# EAGLE design source_eagle (EAGLE 9.6.2)
COMPANY: ADAFRUIT INDUSTRIES; DRAWN: KTOWN; REV: A
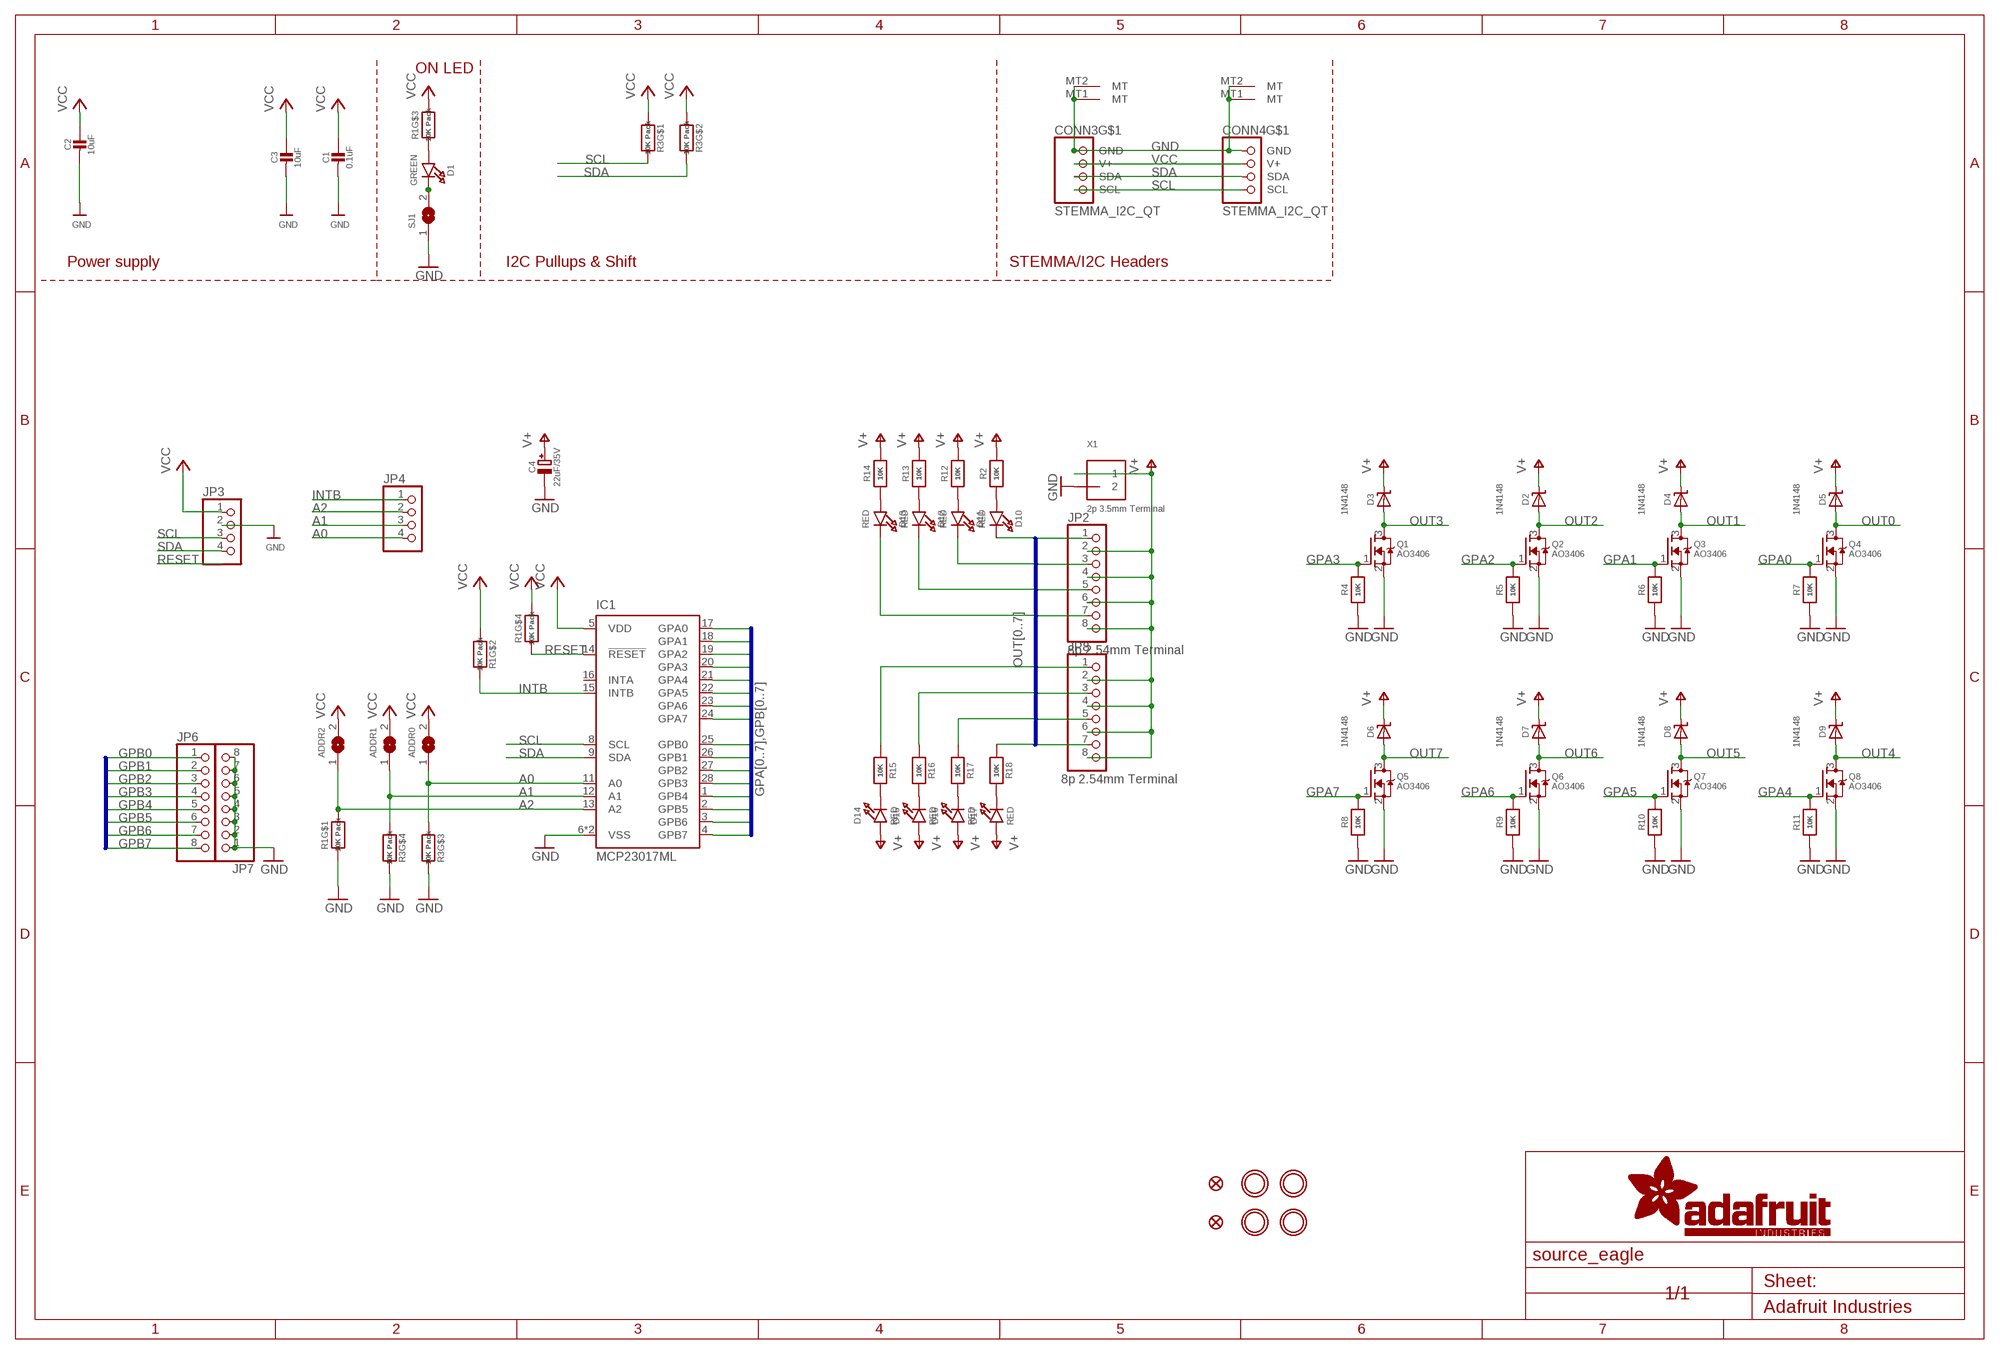
[diagram p0: schematic, sheet 1]

## Parts
ADDR0  SOLDERJUMPER  [SOLDERJUMPER_ARROW_NOPASTE]
ADDR1  SOLDERJUMPER  [SOLDERJUMPER_ARROW_NOPASTE]
ADDR2  SOLDERJUMPER  [SOLDERJUMPER_ARROW_NOPASTE]
C1  0.1uF  CAP_CERAMIC0603_NO  [0603-NO]
C2  10uF  CAP_CERAMIC0805-NOOUTLINE  [0805-NO]
C3  10uF  CAP_CERAMIC0805-NOOUTLINE  [0805-NO]
C4  22uF/35V  CAP_ELECTROLYTICPANASONIC_C  [PANASONIC_C]
CONN3  STEMMA_I2C_QT  [JST_SH4]
CONN4  STEMMA_I2C_QT  [JST_SH4]
D1  GREEN  LED0603_NOOUTLINE  [CHIPLED_0603_NOOUTLINE]
D2  1N4148  DIODE-SCHOTTKYSOD-323  [SOD-323]
D3  1N4148  DIODE-SCHOTTKYSOD-323  [SOD-323]
D4  1N4148  DIODE-SCHOTTKYSOD-323  [SOD-323]
D5  1N4148  DIODE-SCHOTTKYSOD-323  [SOD-323]
D6  1N4148  DIODE-SCHOTTKYSOD-323  [SOD-323]
D7  1N4148  DIODE-SCHOTTKYSOD-323  [SOD-323]
D8  1N4148  DIODE-SCHOTTKYSOD-323  [SOD-323]
D9  1N4148  DIODE-SCHOTTKYSOD-323  [SOD-323]
D10  RED  LED0603_NOOUTLINE  [CHIPLED_0603_NOOUTLINE]
D11  RED  LED0603_NOOUTLINE  [CHIPLED_0603_NOOUTLINE]
D12  RED  LED0603_NOOUTLINE  [CHIPLED_0603_NOOUTLINE]
D13  RED  LED0603_NOOUTLINE  [CHIPLED_0603_NOOUTLINE]
D14  RED  LED0603_NOOUTLINE  [CHIPLED_0603_NOOUTLINE]
D15  RED  LED0603_NOOUTLINE  [CHIPLED_0603_NOOUTLINE]
D16  RED  LED0603_NOOUTLINE  [CHIPLED_0603_NOOUTLINE]
D17  RED  LED0603_NOOUTLINE  [CHIPLED_0603_NOOUTLINE]
FID3  FIDUCIAL_1MM  [FIDUCIAL_1MM]
FID4  FIDUCIAL_1MM  [FIDUCIAL_1MM]
IC1  MCP23017ML  [QFN28-ML_6X6MM]
JP2  8p 2.54mm Terminal  HEADER-1X8_2.54MMTERM  [1X08_2.54MMTERMINAL]
JP3  HEADER-1X4ROUND  [1X04_ROUND]
JP4  HEADER-1X4ROUND  [1X04_ROUND]
JP6  HEADER-1X870MIL  [1X08_ROUND_70]
JP7  HEADER-1X870MIL  [1X08_ROUND_70]
JP8  8p 2.54mm Terminal  HEADER-1X8_2.54MMTERM  [1X08_2.54MMTERMINAL]
Q1  AO3406  MOSFET-NWIDE  [SOT23-WIDE]
Q2  AO3406  MOSFET-NWIDE  [SOT23-WIDE]
Q3  AO3406  MOSFET-NWIDE  [SOT23-WIDE]
Q4  AO3406  MOSFET-NWIDE  [SOT23-WIDE]
Q5  AO3406  MOSFET-NWIDE  [SOT23-WIDE]
Q6  AO3406  MOSFET-NWIDE  [SOT23-WIDE]
Q7  AO3406  MOSFET-NWIDE  [SOT23-WIDE]
Q8  AO3406  MOSFET-NWIDE  [SOT23-WIDE]
R1  10K Pack  RESISTOR_4PACK  [RESPACK_4X0603]
R2  10K  RESISTOR_0603_NOOUT  [0603-NO]
R3  10K Pack  RESISTOR_4PACK  [RESPACK_4X0603]
R4  10K  RESISTOR_0603_NOOUT  [0603-NO]
R5  10K  RESISTOR_0603_NOOUT  [0603-NO]
R6  10K  RESISTOR_0603_NOOUT  [0603-NO]
R7  10K  RESISTOR_0603_NOOUT  [0603-NO]
R8  10K  RESISTOR_0603_NOOUT  [0603-NO]
R9  10K  RESISTOR_0603_NOOUT  [0603-NO]
R10  10K  RESISTOR_0603_NOOUT  [0603-NO]
R11  10K  RESISTOR_0603_NOOUT  [0603-NO]
R12  10K  RESISTOR_0603_NOOUT  [0603-NO]
R13  10K  RESISTOR_0603_NOOUT  [0603-NO]
R14  10K  RESISTOR_0603_NOOUT  [0603-NO]
R15  10K  RESISTOR_0603_NOOUT  [0603-NO]
R16  10K  RESISTOR_0603_NOOUT  [0603-NO]
R17  10K  RESISTOR_0603_NOOUT  [0603-NO]
R18  10K  RESISTOR_0603_NOOUT  [0603-NO]
SJ1  SOLDERJUMPERCLOSED  [SOLDERJUMPER_CLOSEDWIRE]
U$1  MOUNTINGHOLE2.5  [MOUNTINGHOLE_2.5_PLATED]
U$17  MOUNTINGHOLE2.5  [MOUNTINGHOLE_2.5_PLATED]
U$19  MOUNTINGHOLE2.5  [MOUNTINGHOLE_2.5_PLATED]
U$21  MOUNTINGHOLE2.5  [MOUNTINGHOLE_2.5_PLATED]
X1  2p 3.5mm Terminal  TERMBLOCK_1X2_3.5MM  [TERMBLOCK_1X2-3.5MM]

## Nets
A0: ADDR0.1 IC1.11(A0) JP4.4 R3.3
A1: ADDR1.1 IC1.12(A1) JP4.3 R3.4
A2: ADDR2.1 IC1.13(A2) JP4.2 R1.8
GND [highpower]: C1.2 C2.2 C3.2 C4.- CONN3.1(GND) CONN3.MT1(MT) CONN3.MT2(MT) CONN4.1(GND) CONN4.MT1(MT) CONN4.MT2(MT) IC1.6(VSS) IC1.EXP(VSS) JP3.2 JP7.1 JP7.2 JP7.3 JP7.4 JP7.5 JP7.6 JP7.7 JP7.8 Q1.2(S) Q2.2(S) Q3.2(S) Q4.2(S) Q5.2(S) Q6.2(S) Q7.2(S) Q8.2(S) R1.1 R3.5 R3.6 R4.1 R5.1 R6.1 R7.1 R8.1 R9.1 R10.1 R11.1 SJ1.1 X1.2
GPA0: IC1.17(GPA0) Q4.1(G) R7.2
GPA1: IC1.18(GPA1) Q3.1(G) R6.2
GPA2: IC1.19(GPA2) Q2.1(G) R5.2
GPA3: IC1.20(GPA3) Q1.1(G) R4.2
GPA4: IC1.21(GPA4) Q8.1(G) R11.2
GPA5: IC1.22(GPA5) Q7.1(G) R10.2
GPA6: IC1.23(GPA6) Q6.1(G) R9.2
GPA7: IC1.24(GPA7) Q5.1(G) R8.2
GPB0: IC1.25(GPB0) JP6.1
GPB1: IC1.26(GPB1) JP6.2
GPB2: IC1.27(GPB2) JP6.3
GPB3: IC1.28(GPB3) JP6.4
GPB4: IC1.1(GPB4) JP6.5
GPB5: IC1.2(GPB5) JP6.6
GPB6: IC1.3(GPB6) JP6.7
GPB7: IC1.4(GPB7) JP6.8
INTB: IC1.15(INTB) JP4.1 R1.7
N$1: D1.A R1.3
N$2: D1.C SJ1.2
N$3: D10.A R2.1
N$4: D11.A R12.1
N$5: D12.A R13.1
N$6: D13.A R14.1
N$7: D14.C R15.2
N$8: D15.C R16.2
N$9: D16.C R17.2
N$10: D17.C R18.2
OUT0: D5.A D10.C JP2.1 Q4.3(D)
OUT1: D4.A D11.C JP2.3 Q3.3(D)
OUT2: D2.A D12.C JP2.5 Q2.3(D)
OUT3: D3.A D13.C JP2.7 Q1.3(D)
OUT4: D9.A JP8.1 Q8.3(D) R15.1
OUT5: D8.A JP8.3 Q7.3(D) R16.1
OUT6: D7.A JP8.5 Q6.3(D) R17.1
OUT7: D6.A JP8.7 Q5.3(D) R18.1
RESET: IC1.14(!RESET) R1.4
SCL: CONN3.4(SCL) CONN4.4(SCL) IC1.8(SCL) JP3.3 R3.8
SDA: CONN3.3(SDA) CONN4.3(SDA) IC1.9(SDA) JP3.4 R3.7
V+: C4.+ D2.C D3.C D4.C D5.C D6.C D7.C D8.C D9.C D14.A D15.A D16.A D17.A JP2.2 JP2.4 JP2.6 JP2.8 JP8.2 JP8.4 JP8.6 JP8.8 R2.2 R12.2 R13.2 R14.2 X1.1
VCC [highpower]: ADDR0.2 ADDR1.2 ADDR2.2 C1.1 C2.1 C3.1 CONN3.2(V+) CONN4.2(V+) IC1.5(VDD) JP3.1 R1.2 R1.5 R1.6 R3.1 R3.2
Unconnected: IC1.16(INTA)

## Buses
GPA[0..7],GPB[0..7]
OUT[0..7]

## Notes on the sheet
- ON LED
- Power supply | I2C Pullups & Shift | STEMMA/I2C Headers

## Library data of the parts
ADDR0 ADDR1 ADDR2 = microbuilder:SOLDERJUMPER: SMD Solder JUMPER Solder the two pads together to create a connection, or remove the solder to break it. REFLOW - Use this footprint for solder paste and reflow ovens. WAVE - Use this footprint for hand-soldering (larger pads). CLOSED - Has a trace between the two pads to ensure it is closed by default. The trace needs to be cut to disable the jumper, and can be closed again by creating a solder bridge between the two pads.; BOM: EXCLUDE
C1-C3 = microbuilder:CAP_CERAMIC: Ceramic Capacitors For new designs, use the packages preceded by an '_' character since they are more reliable: The following footprints should be used on most boards: _0402 - Standard footprint for regular board layouts _0603 - Standard footprint for regular board layouts _0805 - Standard footprint for regular board layouts _1206 - Standard footprint for regular board layouts For extremely tight-pitch boards where space is at a premium, the following 'micro-pitch' footprints can be used (smaller pads, no silkscreen outline, etc.): _0402MP - Micro-pitch footprint for very dense/compact boards _0603MP - Micro-pitch footprint for very dense/compact boards _0805MP - Micro-pitch footprint for very dense/compact boards _1206MP - Micro-pitch footprint for very dense/compact boards
C4 = microbuilder:CAP_ELECTROLYTIC: Electrolytic Capacitors SMT PANASONIC_C - Size C Panasonic Electrolytic Aluminum Capacitor 47µF 16V 20% Electrolytic Capacitor [Digikey: PCE3890TR-ND] PANASONIC_D - Size D Panasonic Electrolytic Aluminum Capacitor 100µF 25V 20% Electrolytic Capacitor [Digikey: PCE3898TR-ND] PTH 3.5 mm grid, 8 mm diameter ... 3.5 mm grid, 10 mm diameter ...
CONN3 CONN4 = adafruit_electromech:STEMMA_I2C; LCSC: C2845363
D1 D10-D17 = microbuilder:LED: LED 0603 - 0603 Surface Mount Package 2mA: Green LED - Low Power (3.9mcd, 2ma, 1.7Vf) - Digikey: 475-2709-2-ND Orange LED - Low Power (9.8mcd, 2ma, 1.8Vf) - Digikey: 475-1194-2-ND Red LED - Low Power (5mcd, 2ma, 1.8Vf) - Digikey: 475-1195-2-ND Yellow LED - Low Power (7mcd, 2ma, 1.8Vf) - Digikey: 475-1196-2-ND 5mA: Blue LED - Low Power (17mcd, 5ma, 2.9Vf) - Digikey: LNJ937W8CRACT-ND 0805 - 0805 Surface Mount Package 2mA: Red LED (8.8mcd, 2mA, 1.8Vf, Clear) - Low Power [Digikey: 475-2510-1-ND] Green LED (5mcd, 2mA, 1.8Vf, Clear) - Low Power [Digikey: 475-2730-1-ND] Yellow LED (11.3mcd, 2mA, 1.8Vf, Clear) - Low Power [Digikey: 475-2555-1-ND] 20mA: Red LED (104mcd, 20mA, Diffused) - LS R976 [Digikey: 475-1278-6-ND] Red LED (12mcd, 20mA, 2.0Vf, Clear) - APT2012EC [Digikey: 754-1128-1-ND] Green LED (15mcd, 20mA, 2.2Vf, Clear) - APT2012GC [Digikey: 754-1131-1-ND] Orange LED (160mcd, 20mA, 2.1Vf, Clear) - APT2012SECK [Digikey: 754-1130-1-ND] 1206 - 1206 Surface Mount Package Green LED (26mcd, 20mA, Diffused) - LG N971 [Digikey: 475-1407-6-ND] Red LED (15mcd, 20mA, Diffused) - LH N974 [Digikey: 475-1416-6-ND] Cree - Cree High-Power Surface Mount LEDs XPEBWT-L1-0000-00D50 - White 111lm 350mA 2.9Vf 6200K 110° XTEAWT-00-0000-00000LEE3 - White 114lm 350mA 2.85Vf 5000K 115° Everlight - Everlight 45-21 Series Surface Mount LEDs 45-21/QK2C-B2832AC2CB2/2T - Warm White 2000mcd 20mA 3.25Vf 3050K 120° 45-21/LK2C-B38452C4CB2/2T - Nuetral White 2000mcd 20mA 3.25Vf 4150K 120° 45-21/LK2C-B50634C6CB2/2T - Cold White 2200mcd 20mA 3.25Vf 5650K 120° PLCC2 Reverse Mount LS T77K-J1L2-1-0-2-R18-Z - Red 11.25mcd 2mA 1.8Vf 630nm 120° LO T77K-L1M2-24-Z - Orange 19.6mcd 2mA 1.8Vf 606nm 120° LY T77K-K2M1-26-Z - Yellow 15.7mcd 2mA 1.8Vf 587nm 120°; ROT: 270
D2-D9 = microbuilder:DIODE-SCHOTTKY
FID3 FID4 = microbuilder:FIDUCIAL: Fiducial Alignment Points Various fiducial points for machine vision alignment.; BOM: EXCLUDE
IC1 = microbuilder:MCP23017: http://ww1.microchip.com/downloads/en/DeviceDoc/21952a.pdf Source: http://ww1.microchip.com/downloads/en/DeviceDoc/21952a.pdf; MF: MICROCHIP; MPN: MCP23017-E/ML; OC_FARNELL: unknown; OC_NEWARK: 31K2957
JP2 JP6-JP8 = microbuilder:HEADER-1X8: PIN HEADER
JP3 JP4 = microbuilder:HEADER-1X4: PIN HEADER
Q1-Q8 = microbuilder:MOSFET-N: N-Channel Mosfet LEGEND VDS: Voltage Drain-Source ID: Drain Current RDS(ON): Drain-Source On-State Resistance VGS(TH): Gate-Source Threshold Voltage CISS: Drain-Source Input Capacitance SOT-23 Name VDS ID RDS(ON) VGS(TH) CISS Order Number 2N7002E 60V 260mA 2.5 Ohm 2.5V @ 250uA 26.7pF @ 25V 2N7002ET1GOSTR-ND BSH103 30V 850mA 400 mOhm 400mV @ 1mA 83pF @ 24V BSH103,235-ND BSS138 60V 320mA 1.6 Ohm 1.5V @ 250uA 50pF @ 10V Mouser: 771-BSS138PW115 DMN2075U-7 20V 4.2A 38 mOhm 1V @ 250 uA 594.3pF @ 10V DMN2075U-7DICT-ND * BSS138 good choice for I2C level-shifting POWERPAK 1212-8 Name VDS ID RDS(ON) VGS(TH) CISS Order Number Si7308DN 60V 6A 58 mOhm 3V @ 250uA 665pF @ 15V SI7308DN-T1-E3CT-ND
R1 R3 = microbuilder:RESISTOR_4PACK: Resistor Packs (4 resistors) 4 x 0603 10K 1/16W - Digikey: YC164J-10KCT-ND
R2 R4-R18 = microbuilder:RESISTOR: Resistors For new designs, use the packages preceded by an '_' character since they are more reliable: The following footprints should be used on most boards: _0402 - Standard footprint for regular board layouts _0603 - Standard footprint for regular board layouts _0805 - Standard footprint for regular board layouts _1206 - Standard footprint for regular board layouts For extremely tight-pitch boards where space is at a premium, the following 'micro-pitch' footprints can be used (smaller pads, no silkscreen outline, etc.): _0402MP - Micro-pitch footprint for very dense/compact boards _0603MP - Micro-pitch footprint for very dense/compact boards _0805MP - Micro-pitch footprint for very dense/compact boards _1206MP - Micro-pitch footprint for very dense/compact boards
SJ1 = microbuilder:SOLDERJUMPER: SMD Solder JUMPER Solder the two pads together to create a connection, or remove the solder to break it. REFLOW - Use this footprint for solder paste and reflow ovens. WAVE - Use this footprint for hand-soldering (larger pads). CLOSED - Has a trace between the two pads to ensure it is closed by default. The trace needs to be cut to disable the jumper, and can be closed again by creating a solder bridge between the two pads.
U$1 U$17 U$19 U$21 = adafruit_electromech:MOUNTINGHOLE: Mounting Hole For #2 screws (0.086"/2.18mm width, 0.094"/2.4mm hole) use 2.5mm; BOM: EXCLUDE
X1 = adafruit_electromech:TERMBLOCK_1X2: 3.5mm Terminal block http://www.ladyada.net/library/pcb/eaglelibrary.html; ROT: 0

## Net classes
1 highpower: width 0.305 mm, drill 0.483 mm
2 lowpower: width 0.254 mm, drill 0.483 mm

## Board
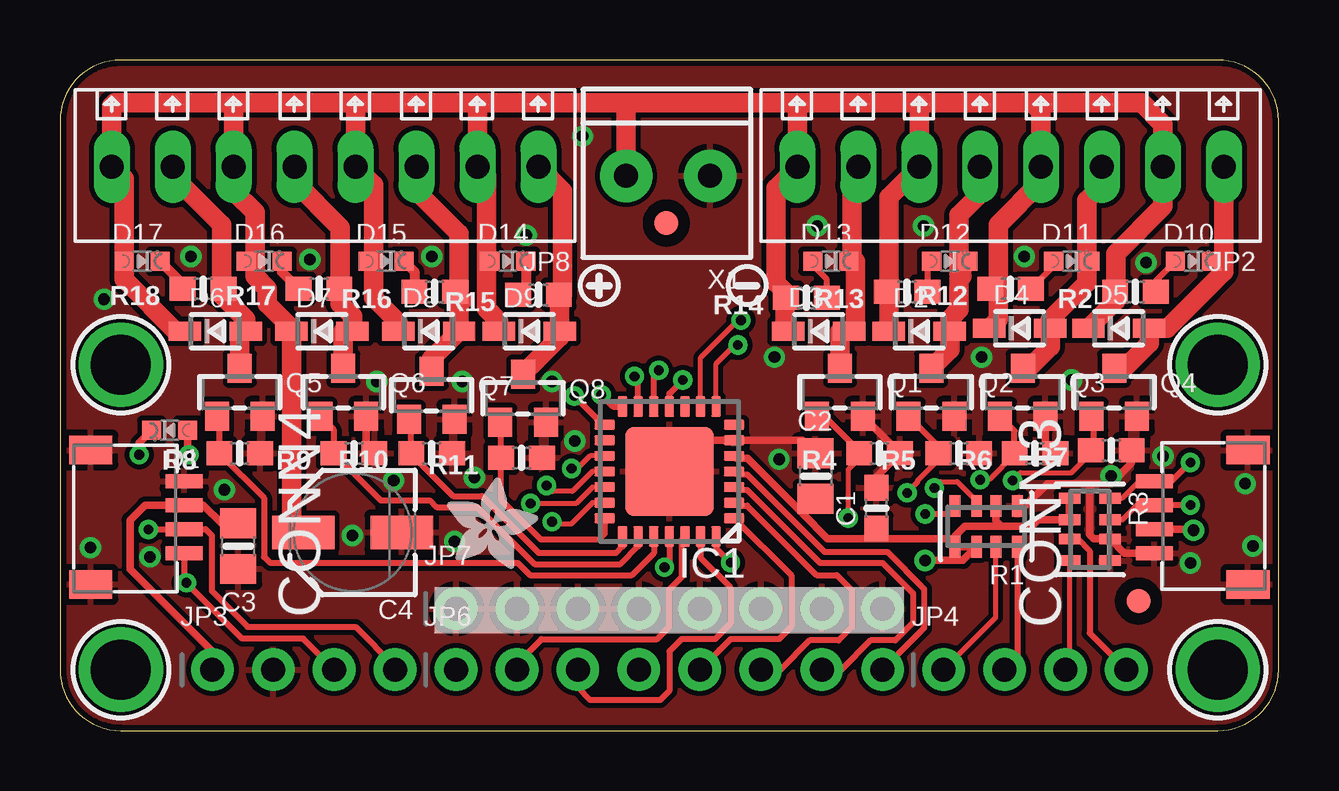
[diagram p1: board, top side]
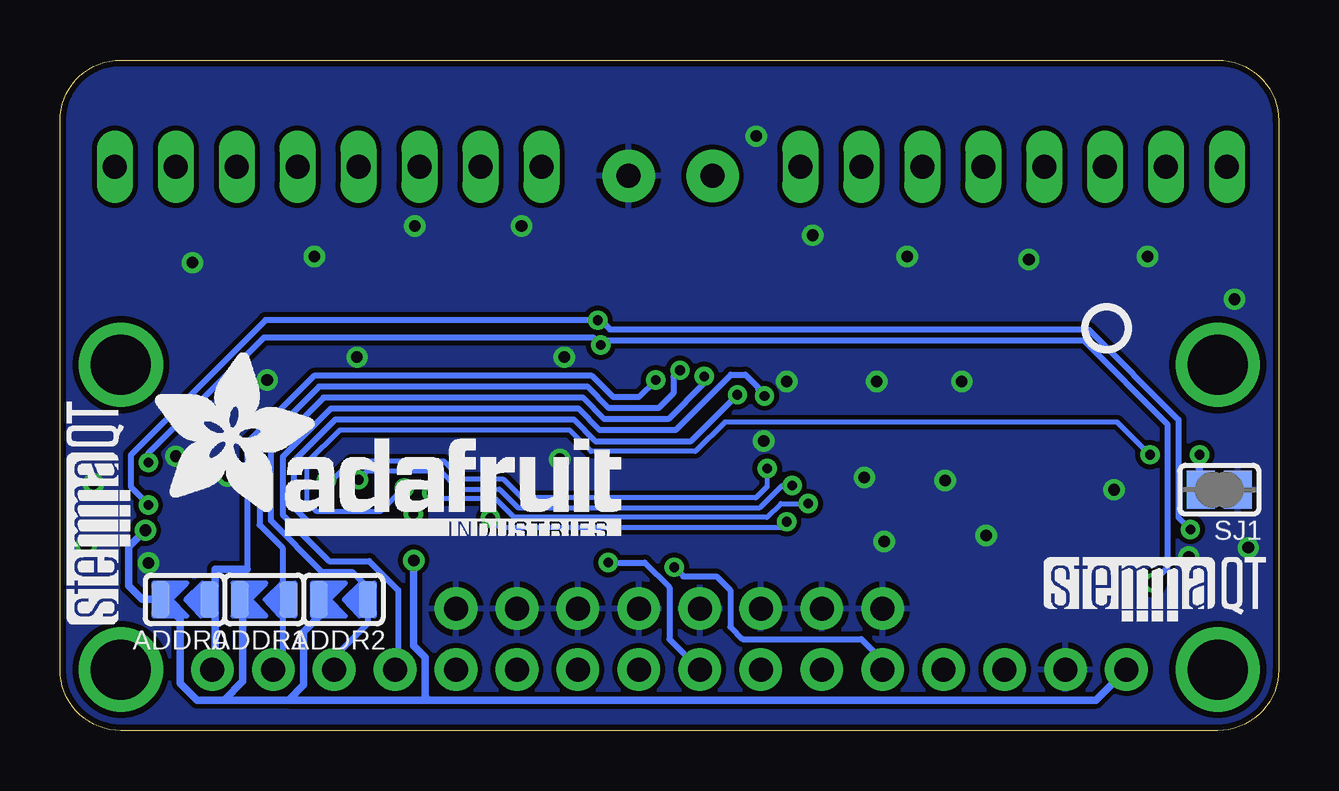
[diagram p2: board, bottom side, seen from below]

Size 50.8 x 27.94 mm. Coordinates in mm from the lower left corner, seen from the top.
Outline: 0,25.4 0,2.54 arc90 2.54,0 48.26,0 arc90 50.8,2.54 50.8,25.4 arc90 48.26,27.94 2.54,27.94 arc90 0,25.4
Copper layers (1*16): Top 0.035mm / dielectric 1.5mm / Bottom 0.035mm
Design rules "adafruit *": minimum track width 8mil, minimum drill 15.5mil, track to track 8mil, track to pad 8mil, pad to pad 8mil, via to via 8mil, smd to smd 8mil, copper to edge 10mil, drill to drill 8mil, minimum pad ring 10mil, minimum via ring 8mil, stop-mask expansion 2mil, vias tented up to drill 20mil, thermal gap 10mil

### Footprints (pad centres in the part's own frame; a part is rotated, then mirrored left to right if it is on the bottom)
SOLDERJUMPER_ARROW_NOPASTE = smd 0.762 x 1.524: 1 -1.016,0; 2 1.016,0
0603-NO = smd 1.075 x 1: 1 -0.85,0; 2 0.85,0
0805-NO = smd 1.24 x 1.5: 1 -0.95,0; 2 0.95,0
PANASONIC_C = smd 2.6 x 1.4: + 2.05,0; - -2.05,0
JST_SH4 = smd 0.6 x 1.55: 1 -1.5,2.006; 2 -0.5,2.006; 3 0.5,2.006; 4 1.5,2.006 | smd 1.2 x 1.8: MT1 -2.8,-1.894; MT2 2.8,-1.894
CHIPLED_0603_NOOUTLINE = smd 0.8 x 0.8: A 0,-0.75; C 0,0.75
SOD-323 = smd 1.35 x 0.8: A 1.27,0; C -1.27,0
FIDUCIAL_1MM = smd 1 x 1: 1 0,0
QFN28-ML_6X6MM = smd 0.85 x 0.4: 1 -2.7,1.95; 2 -2.7,1.3; 3 -2.7,0.65; 4 -2.7,0; 5 -2.7,-0.65; 6 -2.7,-1.3; 7 -2.7,-1.95; 15 2.7,-1.95; 16 2.7,-1.3; 17 2.7,-0.65; 18 2.7,0; 19 2.7,0.65; 20 2.7,1.3; 21 2.7,1.95 | smd 0.4 x 0.85: 8 -1.95,-2.7; 9 -1.3,-2.7; 10 -0.65,-2.7; 11 0,-2.7; 12 0.65,-2.7; 13 1.3,-2.7; 14 1.95,-2.7; 22 1.95,2.7; 23 1.3,2.7; 24 0.65,2.7; 25 0,2.7; 26 -0.65,2.7; 27 -1.3,2.7; 28 -1.95,2.7 | smd 3.7 x 3.7: EXP 0,0
1X08_2.54MMTERMINAL = drill 1 long: 1 8.89,0; 2 6.35,0; 3 3.81,0; 4 1.27,0; 5 -1.27,0; 6 -3.81,0; 7 -6.35,0; 8 -8.89,0
1X04_ROUND = drill 1 pad 1.778: 1 -3.81,0; 2 -1.27,0; 3 1.27,0; 4 3.81,0
1X08_ROUND_70 = drill 1 pad 1.778: 1 -8.89,0; 2 -6.35,0; 3 -3.81,0; 4 -1.27,0; 5 1.27,0; 6 3.81,0; 7 6.35,0; 8 8.89,0
SOT23-WIDE = smd 1 x 1.2: 1 -0.95,-1; 2 0.95,-1; 3 0,1
RESPACK_4X0603 = smd 0.45 x 0.9: 1 -1.3,-0.85; 2 -0.4,-0.85; 3 0.4,-0.85; 4 1.3,-0.85; 5 1.3,0.85; 6 0.4,0.85; 7 -0.4,0.85; 8 -1.3,0.85
SOLDERJUMPER_CLOSEDWIRE = smd 1.168 x 1.6: 1 -0.762,0; 2 0.762,0 | smd 0.635 x 0.203: WIRE 0,0
MOUNTINGHOLE_2.5_PLATED = drill 2.5 pad 3.2: P$1 0,0
TERMBLOCK_1X2-3.5MM = drill 1 pad 2.184: 1 1.8,0; 2 -1.7,0

### Placement (x,y rotation side)
ADDR0  45.59,5.46 180 bottom
ADDR1  42.29,5.46 180 bottom
ADDR2  38.99,5.46 180 bottom
C1  34.04,9.27 90 top
C2  31.5,10.6 90 top
C3  7.43,7.68 270 top
C4  12.19,8.26 180 top
CONN3  47.62,8.89 90 top
CONN4  3.17,8.89 270 top
D1  4.57,12.51 90 top
D2  35.81,16.64 0 top
D3  31.62,16.64 0 top
D4  40.01,16.76 0 top
D5  44.13,16.76 0 top
D6  6.48,16.64 0 top
D7  10.92,16.64 0 top
D8  15.37,16.64 0 top
D9  19.56,16.64 0 top
D10  47.24,19.56 270 top
D11  42.16,19.56 270 top
D12  37.08,19.56 270 top
D13  32.13,19.56 270 top
D14  18.67,19.56 270 top
D15  13.59,19.56 270 top
D16  8.51,19.56 270 top
D17  3.43,19.56 270 top
FID3  25.27,21.15 0 top
FID4  44.96,5.4 0 top
IC1  25.4,10.79 180 top
JP2  39.62,23.5 0 top
JP3  10.16,2.54 0 top
JP4  40.64,2.54 0 top
JP6  25.4,2.54 0 top
JP7  25.4,5.08 0 top
JP8  11.05,23.5 0 top
PLABEL0  [PLABEL0]  12.45,27.3 0 top
PLABEL1  [PLABEL1]  17.59,27.3 0 top
PLABEL2  [PLABEL2]  7.37,27.37 0 top
PLABEL3  [PLABEL3]  2.35,27.37 0 top
PLABEL4  [PLABEL4]  30.86,27.3 0 top
PLABEL5  [PLABEL5]  35.94,27.3 0 top
PLABEL6  [PLABEL6]  41.02,27.3 0 top
PLABEL7  [PLABEL7]  46.1,27.3 0 top
PLABEL8  [PLABEL8]  48.51,27.43 90 top
PLABEL9  [PLABEL9]  43.43,27.43 90 top
PLABEL10  [PLABEL10]  38.29,27.43 90 top
PLABEL11  [PLABEL11]  33.34,27.43 90 top
PLABEL12  [PLABEL12]  19.94,27.43 90 top
PLABEL13  [PLABEL13]  9.72,27.43 90 top
PLABEL14  [PLABEL14]  14.92,27.43 90 top
PLABEL15  [PLABEL15]  4.7,27.43 90 top
PLABEL16  [PLABEL16]  23.81,27.37 0 top
PLABEL17  [PLABEL17]  27.18,27.37 0 top
PLABEL18  [PLABEL18]  6.29,0.89 0 top
PLABEL19  [PLABEL19]  9.02,4.19 0 top
PLABEL20  [PLABEL20]  11.56,0.89 0 top
PLABEL21  [PLABEL21]  14.1,4.19 0 top
PLABEL22  [PLABEL22]  16.51,0.89 0 top
PLABEL23  [PLABEL23]  19.05,0.89 0 top
PLABEL24  [PLABEL24]  21.59,0.89 0 top
PLABEL25  [PLABEL25]  24.13,0.89 0 top
PLABEL26  [PLABEL26]  26.67,0.89 0 top
PLABEL27  [PLABEL27]  29.21,0.89 0 top
PLABEL28  [PLABEL28]  31.75,0.89 0 top
PLABEL29  [PLABEL29]  34.29,0.89 0 top
PLABEL30  [PLABEL30]  37.08,4.19 0 top
PLABEL31  [PLABEL31]  39.37,0.89 0 top
PLABEL32  [PLABEL32]  42.04,4.19 0 top
PLABEL33  [PLABEL33]  44.45,0.89 0 top
PLABEL34  [PLABEL34]  21.59,6.86 0 top
PLABEL35  [PLABEL35]  30.23,6.86 0 top
PLABEL36  [PLABEL36]  25.65,17.4 0 top
PLABEL37  [PLABEL37]  45.59,7.24 0 bottom
PLABEL38  [PLABEL38]  42.29,7.24 0 bottom
PLABEL39  [PLABEL39]  38.99,7.24 0 bottom
PLABEL40  [PLABEL40]  24.83,17.14 0 bottom
PLABEL41  [PLABEL41]  45.97,26.42 90 bottom
PLABEL42  [PLABEL42]  40.89,26.42 90 bottom
PLABEL43  [PLABEL43]  35.81,26.42 90 bottom
PLABEL44  [PLABEL44]  30.73,26.42 90 bottom
PLABEL45  [PLABEL45]  17.53,26.42 90 bottom
PLABEL46  [PLABEL46]  12.45,26.42 90 bottom
PLABEL47  [PLABEL47]  7.37,26.42 90 bottom
PLABEL48  [PLABEL48]  2.29,26.42 90 bottom
PLABEL49  [PLABEL49]  48.51,26.42 90 bottom
PLABEL50  [PLABEL50]  43.43,26.42 90 bottom
PLABEL51  [PLABEL51]  38.35,26.42 90 bottom
PLABEL52  [PLABEL52]  33.27,26.42 90 bottom
PLABEL53  [PLABEL53]  20.07,26.42 90 bottom
PLABEL54  [PLABEL54]  14.99,26.42 90 bottom
PLABEL55  [PLABEL55]  9.91,26.42 90 bottom
PLABEL56  [PLABEL56]  4.83,26.42 90 bottom
PLABEL57  [PLABEL57]  27.43,25.15 0 bottom
PLABEL58  [PLABEL58]  23.11,25.15 0 bottom
PLABEL59  [PLABEL59]  15.75,10.16 0 bottom
PLABEL60  [PLABEL60]  25.65,26.92 0 bottom
Q1  32.51,14.1 0 top
Q2  36.32,14.1 0 top
Q3  40.13,14.1 0 top
Q4  43.94,14.1 0 top
Q5  7.49,14.1 0 top
Q6  11.81,14.1 0 top
Q7  15.49,13.97 0 top
Q8  19.3,13.84 0 top
R1  38.61,8.51 180 top
R2  44.83,18.29 180 top
R3  42.93,8.38 270 top
R4  34.16,11.56 180 top
R5  37.47,11.56 180 top
R6  40.64,11.56 180 top
R7  43.81,11.68 180 top
R8  7.49,11.56 180 top
R9  12.26,11.56 180 top
R10  15.49,11.56 180 top
R11  19.24,11.37 180 top
R12  39.62,18.41 180 top
R13  35.31,18.29 180 top
R14  31.11,18.03 180 top
R15  19.94,18.16 180 top
R16  15.62,18.29 180 top
R17  10.79,18.41 180 top
R18  5.97,18.41 180 top
SJ1  2.48,10.03 180 bottom
U$1  2.54,15.24 0 top
U$2  PLUS  [SYMBOL_PLUS]  22.48,18.54 0 top
U$3  [SYMBOL_MINUS]  28.64,18.54 0 top
U$4  [ADAFRUIT_3.5MM]  16.13,6.73 0 top
U$7  [ADAFRUIT_TEXT_20MM]  46.99,8.13 0 bottom
U$17  48.26,15.24 0 top
U$19  2.54,2.54 0 top
U$21  48.26,2.54 0 top
U$25  [PCBFEAT-REV-040]  7.18,16.76 0 bottom
U$30  [STEMMAQT]  47.88,4.45 90 bottom
U$31  [STEMMAQT]  9.78,4.57 0 bottom
X1  25.4,23.11 180 top

### Tracks (layer width: path | path; a pad name or v marks a point on that pad's centre or on a via)
A0  (via drill 0.4)
  Top 0.254: R3.3 42.42,7.98 42.93,7.47 42.93,4.06 JP4.4 | IC1.11 25.4,14.04 v25.96,14.61
  Bottom 0.254: v25.96,14.61 26.68,13.89 27.74,13.89 28.63,14.78 40.21,14.78 42.99,12 42.99,6.73
  Bottom 0.305: 44.32,5.71 44.32,6.73 42.99,6.73 | 44.32,5.71 44.32,2.67 JP4.4 | ADDR0.1 44.32,5.71
A1  (via drill 0.4)
  Top 0.203: R3.4 42.08,2.71 JP4.3
  Top 0.254: IC1.12 24.75,14.81 v24.96,15.01
  Bottom 0.254: v24.96,15.01 25.23,14.74 25.23,14.05 25.84,13.44 27.93,13.44 28.82,14.33 40.01,14.33 42.48,11.85 42.48,8.57 41.53,7.62 41.53,5.33 41.53,2.92 JP4.3
  Bottom 0.305: 41.53,5.33 41.4,5.33 ADDR1.1
A2  (via drill 0.4)
  Top 0.254: R1.8 39.91,3.08 JP4.2 | IC1.13 24.1,14.61 v23.95,14.76
  Bottom 0.254: JP4.2 39.37,3.05 37.97,4.45 ADDR2.1 37.97,5.97 38.61,6.6 39.87,6.6 42.02,8.76 42.02,11.67 39.82,13.87 29,13.87 28.12,12.98 25.45,12.98 23.98,14.45 23.98,14.57 23.95,14.54 v23.95,14.76
GND  (via drill 0.48)
  Top 0.305: IC1.EXP 26.7,12.1 IC1.6 30.96,12.1 C2.2 | R6.1 41.08,11.96 Q3.2 | Q1.2 33.47,13.1 R4.1 34.04,10.58 C1.2 | R7.1 44.66,11.14 43.81,10.29 42.93,10.29 | R1.1 40.22,9.36 41.15,10.29 42.93,10.29 | 42.93,10.29 42.93,8.16 43.1,7.98 R3.6 44.37,7.39 CONN3.1 | Q6.2 12.76,11.9 R9.1
  other vias: 1.27,7.62 3.75,7.24 6.86,10.03 13.91,10.41 17.27,10.54 29.97,11.3 21.46,12.06 42.16,14.61 45.97,11.43 43.81,10.6 47.12,6.99 49.72,7.68 49.4,10.29 1.84,17.97 21.78,24.77 13.21,14.54 16.76,14.54 20.51,14.54 29.78,15.56 36,21.02 38.42,15.56 12.19,8.13 16.45,7.87 5.46,19.75 10.41,19.62 15.49,19.75 19.43,20.64 40.2,19.75 31.56,21.02 45.28,19.49
  pour Top: 0,0 0,27.94 50.8,27.94 50.8,0
  pour Bottom: 0,0 0,27.94 50.8,27.94 50.8,0
GPA0  (via drill 0.4)
  Top 0.203: IC1.17 22.09,11.45 21.58,10.93 v21.32,10.93 | v39.7,10.41 40.04,10.75 42.16,10.75 43.09,11.68
  Top 0.254: R7.2 43.09,11.68 43.09,13 Q4.1
  Bottom 0.203: v21.32,10.93 21.32,10.17 21.8,9.69 31.54,9.69 32.32,10.46 34.03,10.46 34.79,11.22 38.66,11.22 39.47,10.41 v39.7,10.41
GPA1  (via drill 0.4)
  Top 0.203: IC1.18 22.19,10.79 21.36,9.96 20.54,9.96 v20.28,10.22 | R6.2 39.79,11.51 38.73,10.45 v38.35,10.45
  Top 0.254: R6.2 39.79,12.49 Q3.1
  Bottom 0.203: v38.35,10.45 37.99,10.82 34.96,10.82 34.2,10.06 32.48,10.06 31.71,9.28 21.63,9.28 20.7,10.22 v20.28,10.22
GPA2  (via drill 0.4)
  Top 0.203: IC1.19 22.19,10.14 21.5,9.45 v19.61,9.45 | v35.31,9.91 35.74,10.34 35.74,10.4 36.62,11.28 R5.2
  Top 0.254: R5.2 36.62,11.85 Q2.1
  Bottom 0.203: v35.31,9.91 35.05,9.65 32.65,9.65 31.88,8.88 21.33,8.88 20.76,9.45 v19.61,9.45
GPA3  (via drill 0.4)
  Top 0.203: IC1.20 22.19,9.49 21.3,8.61 20.6,8.61 v20.51,8.7 | v32.85,8.85 32.85,10.88 33.31,11.34 R4.2
  Top 0.254: R4.2 33.31,11.64 31.86,13.1 Q1.1
  Bottom 0.203: v32.85,8.85 32.47,8.47 20.74,8.47 v20.51,8.7
GPA4
  Top 0.254: Q8.1 18.39,12.81 R11.2 18.39,9.61 20.05,7.96 22.45,7.96 22.7,8.21 IC1.21
GPA5
  Top 0.254: Q7.1 14.64,12.87 R10.2 14.64,11.52 16.4,9.77 17.59,9.77 19.97,7.39 23.17,7.39 23.45,7.67 IC1.22
GPA6
  Top 0.254: Q6.1 11.4,12.55 R9.2 13.37,9.59 15.42,9.59 15.7,9.31 17.4,9.31 19.78,6.93 23.36,6.93 24.1,7.68 IC1.23
GPA7
  Top 0.254: Q5.1 6.64,13 R8.2 8.51,9.69 8.51,7.24 8.76,6.99 19.08,6.99 19.59,6.48 23.83,6.48 24.75,7.39 IC1.24
GPB0  (via drill 0.4)
  Top 0.254: IC1.25 25.4,7.01 v25.2,6.8
  Bottom 0.254: v25.2,6.8 24.82,6.42 23.44,6.42 22.86,5.84 22.86,4.32 22.35,3.81 17.4,3.81 16.51,2.92 JP6.1
GPB1
  Top 0.254: JP6.2 19.05,2.79 20.07,3.81 24.89,3.81 25.4,4.32 25.4,5.88 25.93,6.41 25.93,7.97 IC1.26
GPB2
  Top 0.254: IC1.27 26.7,7.21 27.94,5.97 27.94,4.45 27.3,3.81 25.91,3.81 25.4,3.3 25.4,1.65 25.02,1.27 22.1,1.27 21.59,1.78 JP6.3
GPB3  (via drill 0.4)
  Top 0.254: IC1.28 27.35,7.6 v27.95,7
  Bottom 0.254: v27.95,7 26.43,7 25.4,5.97 25.4,3.81 JP6.4
GPB4
  Top 0.254: IC1.1 30.48,6.46 30.48,4.32 29.97,3.81 27.95,3.81 27.49,3.35 27.48,3.35 JP6.5
GPB5
  Top 0.254: IC1.2 28.22,9.38 28.64,9.38 31.54,6.48 32.38,6.48 33.02,5.84 33.02,4.32 32.46,3.76 31.25,3.76 30.03,2.54 JP6.6
GPB6
  Top 0.254: IC1.3 28.22,10.03 28.64,10.03 31.68,6.99 34.29,6.99 35.56,5.71 35.56,4.5 34.82,3.76 33.78,3.76 32.57,2.54 JP6.7
GPB7
  Top 0.254: IC1.4 28.22,10.68 28.64,10.68 31.87,7.44 34.48,7.44 36.02,5.9 36.02,4.27 JP6.8
INTB  (via drill 0.4)
  Top 0.203: R1.7 39.01,4.72 JP4.1
  Top 0.254: v21.44,13.95 22.64,12.74 IC1.15
  Bottom 0.254: JP4.1 36.7,2.67 36.7,5.85 37.91,7.06 39.57,7.06 41.51,9 41.51,11.41 39.51,13.41 29.19,13.41 28.3,12.52 25.14,12.52 22.83,14.83 22.24,14.83 21.7,14.3 21.7,14.21 v21.44,13.95
N$1  (via drill 0.4)
  Top 0.203: v36.45,10.11 36.71,10.37 37.41,10.37 38.21,9.56 R1.3
  Top 0.305: D1.A 5.32,11.81 5.37,11.77 v5.37,11.49
  Bottom 0.203: v36.45,10.11 37.41,9.14 40.13,9.14 40.51,9.53 40.51,11.15 39.14,12.52 29.56,12.52 28.67,11.63 24.31,11.63 23.09,12.86 6.73,12.86 v5.37,11.49
N$2  (via drill 0.4)
  Top 0.305: D1.C 3.3,11.99 v3.3,11.49
  Bottom 0.305: v3.3,11.49 3.3,10.1 SJ1.2
N$3
  Top 0.254: R2.1 45.68,18.75 D10.A
N$4
  Top 0.254: R12.1 41.41,19.36 D11.A
N$5
  Top 0.254: D12.A 36.16,19.38 R13.1
N$6
  Top 0.254: R14.1 31.96,18.8 31.38,19.38 D13.A
N$7
  Top 0.406: D14.C 19.42,18.49 R15.2
N$8
  Top 0.406: D15.C 14.77,19.13 R16.2
N$9
  Top 0.406: D16.C 9.26,19.1 R17.2
N$10
  Top 0.406: D17.C 5.12,18.62 R18.2
OUT0
  Top 0.254: D10.C 48.51,19.56
  Top 0.813: JP2.1 48.51,19.56 48.51,19.11 46.16,16.76 D5.A 45.4,16.13 44.37,15.1 Q4.3
OUT1
  Top 0.254: D11.C 42.91,19.55 42.8,19.43
  Top 0.813: Q3.3 40.39,15.1 41.27,15.99 D4.A 41.27,17.14 42.8,18.67 42.8,19.43 42.8,22.1 43.31,22.61 43.31,23.37 JP2.3
OUT2
  Top 0.254: D12.C 37.59,19.32 37.59,19.18 37.59,18.92
  Top 0.813: Q2.3 37.08,15.86 D2.A 37.08,17.14 37.47,17.53 37.47,18.8 37.59,18.92 | JP2.5 38.35,22.35 37.47,21.46 37.47,19.05 37.59,19.18
OUT3
  Top 0.254: D13.C 33.02,19.56 33.15,19.56
  Top 0.813: Q1.3 32.51,16.64 D3.A 33.15,16.89 33.15,19.56 | 33.02,19.56 33.02,23.24 JP2.7
OUT4
  Top 0.813: Q8.3 19.3,14.86 20.83,16.38 D9.A 20.83,18.16 | JP8.1 20.95,22.48 20.95,18.16 20.83,18.16 | R15.1 20.83,18.16
OUT5
  Top 0.406: R16.1 16.76,18 16.76,17.91
  Top 0.813: Q7.3 15.49,15.49 D8.A 16.64,18.03 | 16.76,17.91 16.64,18.03 | 16.64,18.03 16.64,20.7 14.86,22.48 JP8.3
OUT6
  Top 0.406: R17.1 11.68,18.38 11.68,18.29
  Top 0.813: Q6.3 11.81,16.64 D7.A 12.19,17.27 11.68,17.78 11.68,18.29 11.68,20.95 9.78,22.86 JP8.5
OUT7
  Top 0.406: 6.78,18.37 R18.1 6.73,18.33 6.73,18.16
  Top 0.813: Q5.3 7.49,16.38 D6.A 7.75,17.14 6.73,18.16 | 6.78,18.37 6.73,18.41 6.73,21.08 4.7,23.11 JP8.7
RESET  (via drill 0.4)
  Top 0.254: R1.4 36.97,9.02 v36.07,9.02 | v22.56,13.99 23.06,13.49 IC1.14
  Bottom 0.254: v22.56,13.99 24.49,12.06 28.49,12.06 29.38,12.95 39.32,12.95 41.05,11.22 41.05,9.3 40.39,8.64 36.45,8.64 v36.07,9.02
SCL  (via drill 0.4)
  Top 0.203: CONN3.4 44.99,10.39 44.28,9.68 R3.8 | IC1.8 27.35,15.29 28.13,16.07 v28.26,16.07
  Top 0.254: CONN3.4 46.33,10.39 v47.12,11.18 | CONN4.4 5.18,6.25 v5.27,6.16 7.59,3.83 10.14,3.83 JP3.3
  Bottom 0.254: v47.12,11.18 47.12,11.56 42.29,16.38 28.57,16.38 v28.26,16.07 28.07,16.26 8.13,16.26 4.63,12.76 4.63,6.79 v5.27,6.16
SDA  (via drill 0.4)
  Top 0.203: CONN3.3 44.89,9.39 44.28,8.78 R3.7 | IC1.9 26.7,15.54 28.26,17.1 v28.38,17.1
  Top 0.254: v47.12,9.4 v47.11,9.39 CONN3.3 | JP3.4 13.97,2.67 12.32,4.32 7.82,4.32 6.32,5.82 6.32,8.14 6.07,8.39 CONN4.3 3.69,8.39 v3.68,8.38
  Bottom 0.254: v47.12,9.4 47.12,9.43 47.85,10.16 47.85,11.48 42.23,17.1 v28.38,17.1 28.26,17.1 27.87,16.71 7.94,16.71 4.18,12.95 4.18,8.88 v3.68,8.38
V+
  Top 0.254: R13.2 34.54,18.38 34.54,18.41 | 39.12,18.29 38.9,18.29 R12.2 | R2.2 44.01,18.29
  Top 0.406: D15.A 12.95,19.56 13.08,19.43 | D16.A 7.89,19.68 8.13,19.68 | D17.A 2.67,19.56 | 30.37,18.14 R14.2 30.27,17.82 30.23,17.78
  Top 0.813: D6.C 4.83,16.64 2.67,18.8 2.67,19.56 2.67,22.99 JP8.8 2.16,26.04 2.29,26.16 7.11,26.16 | 7.11,26.16 12.06,26.16 | 12.06,26.16 17.4,26.16 | 17.4,26.16 JP8.2 17.78,23.11 17.78,19.43 | 12.06,26.16 12.32,25.91 JP8.4 13.08,22.73 13.08,19.43 13.08,18.03 14.1,17.02 D8.C | 7.11,26.16 7.24,26.04 JP8.6 7.24,22.48 8.13,21.59 8.13,19.68 8.13,18.92 8.64,18.41 8.64,17.78 9.65,16.76 D7.C 9.65,8.74 C4.+ | 17.4,26.16 23.37,26.16 | 23.37,26.16 30.73,26.16 | 30.73,26.16 35.81,26.16 | 35.81,26.16 40.51,26.16 | 40.51,26.16 45.09,26.16 45.97,25.27 JP2.2 45.97,21.84 44.01,19.88 44.01,18.29 44.01,17.91 D5.C | 40.51,26.16 40.89,25.78 JP2.4 40.89,22.86 39.12,21.08 39.12,18.29 39.12,17.14 D4.C | 35.81,26.16 JP2.6 34.54,22.23 34.54,18.41 D2.C | 30.73,26.16 JP2.8 29.84,22.61 29.84,18.67 30.37,18.14 | X1.1 23.6,25.93 23.37,26.16 | 30.23,17.78 30.23,16.76 D3.C | D9.C 18.29,17.06 17.78,17.57 17.78,19.43 | D14.A 17.79,19.43 17.78,19.43
VCC  (via drill 0.48)
  Top 0.305: R3.1 R3.2 40.79,8.78 40.51,8.51 39.24,8.51 | R1.2 39.01,8.74 39.24,8.51 | R1.5 37.31,8.1 37.72,8.51 39.24,8.51 | IC1.5 28.19,11.35 28.65,11.35 30.92,9.08 | 30.92,9.08 32,8 34.04,8 | R1.5 36.97,8 34.04,8 | JP3.1 6.35,3.3 2.92,6.73 2.92,8.76 3.55,9.39 CONN4.2 5.97,9.39 6.73,8.63 C3.1 | v47.24,8.35 47.2,8.39 CONN3.2 | C1.1 34.04,8 | C2.1 30.92,9.08 | R1.5 R1.6 37.64,7.09 v36.05,7.09
  Bottom 0.305: v47.24,8.35 47.94,7.65 47.94,6.03 47.37,5.46 ADDR0.2 45.78,4.64 45.78,1.97 45.09,1.27 43.96,1.27 | ADDR1.2 43.18,5.33 43.18,2.05 43.96,1.27 | ADDR2.2 40.01,4.76 40.64,4.13 40.64,1.91 41.27,1.27 | 41.27,1.27 43.96,1.27 | 41.27,1.27 35.43,1.27 | 35.43,1.27 7.62,1.27 JP3.1 | 35.43,1.27 35.59,1.42 35.59,3.06 36.05,3.52 v36.05,7.09

### Text on the board
Pinguin_tBackup: + | 7 | + | 6 | + | 5 | + | 4 | + | - | + | 3 | + | 2 | + | 1 | + | 0 | IA | IB | D0 | D1 | D2 | B7 | B6 | B5 | 24V / Max | B4 | B3 | B2 | B1 | B0 | on | GND | MCP23017 | GND | 16 IO Expander | GND | GND | GND | GND | SDA | SDA | INT | A1 | Vcc | VIN | SCL | SCL | B0 | Rst | B1 | A0 | B2 | A1 | B3 | A2 | B4 | A3 | B5 | A4 | B6 | A5 | B7 | A6 | A7 | A2 | A0
Pinguin_bBackup: PWR IN | V+ | A7 | V+ | A6 | V+ | A5 | V+ | A4 | V+ | A3 | V+ | A2 | V+ | A1 | V+ | A0 | V+ | GND | MCP23017 I2C GPIO Expander / For 8 x Solenoid Drivers / Terminal V+ In: 24VDC Max | INTA | INTB | +1 | +2 | Vcc/Vlogic: 3~5VDC / Def I2C Addr: 0x20 | +4 | MCP23017 | I2C Addr | 16 GPIO expander / Default I2C Addr 0x20 | A2 | A1 | A0